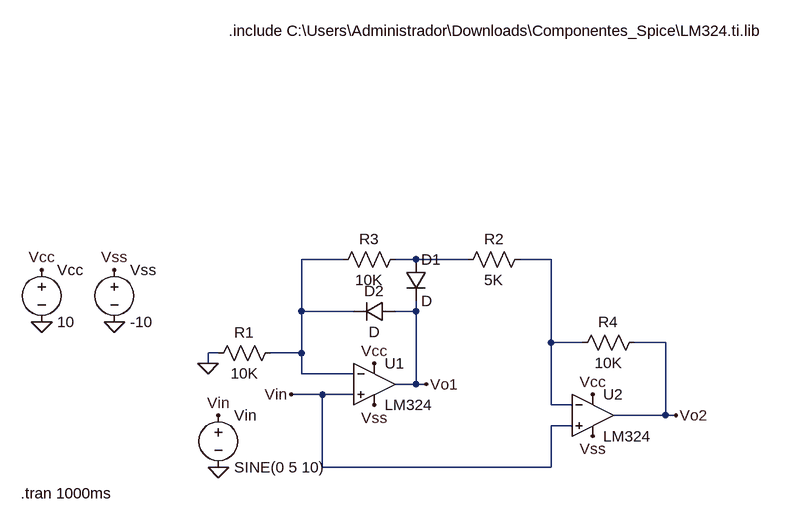
[diagram p0: schematic Rectificador.asc]
Rectificador.asc, the LTspice schematic file:
Version 4
SHEET 1 1024 680
WIRE 96 0 32 0
WIRE 208 0 176 0
WIRE 288 0 208 0
WIRE 416 0 368 0
WIRE 32 80 32 0
WIRE 112 80 32 80
WIRE 208 80 208 64
WIRE 208 80 176 80
WIRE 416 128 416 0
WIRE 464 128 416 128
WIRE 592 128 544 128
WIRE -96 144 -112 144
WIRE 32 144 32 80
WIRE 32 144 -16 144
WIRE -112 160 -112 144
WIRE 32 176 32 144
WIRE 112 176 32 176
WIRE 208 192 208 80
WIRE 208 192 176 192
WIRE 224 192 208 192
WIRE 64 208 16 208
WIRE 112 208 64 208
WIRE 416 224 416 128
WIRE 448 224 416 224
WIRE 592 240 592 128
WIRE 592 240 512 240
WIRE 608 240 592 240
WIRE 448 256 416 256
WIRE 64 320 64 208
WIRE 416 320 416 256
WIRE 416 320 64 320
FLAG -112 160 0
FLAG 16 208 Vin
FLAG 144 160 Vcc
FLAG 480 208 Vcc
FLAG 144 224 Vss
FLAG 480 272 Vss
FLAG -368 96 0
FLAG -256 96 0
FLAG -96 320 0
FLAG -96 240 Vin
FLAG -368 16 Vcc
FLAG -256 16 Vss
FLAG 608 240 Vo2
FLAG 224 192 Vo1
SYMBOL OpAmps\\opamp2 144 128 R0
SYMATTR InstName U1
SYMATTR Value LM324
SYMBOL OpAmps\\opamp2 480 176 R0
SYMATTR InstName U2
SYMATTR Value LM324
SYMBOL res 0 128 R90
WINDOW 0 0 56 VBottom 2
WINDOW 3 32 56 VTop 2
SYMATTR InstName R1
SYMATTR Value 10K
SYMBOL res 384 -16 R90
WINDOW 0 0 56 VBottom 2
WINDOW 3 32 56 VTop 2
SYMATTR InstName R2
SYMATTR Value 5K
SYMBOL res 192 -16 R90
WINDOW 0 0 56 VBottom 2
WINDOW 3 32 56 VTop 2
SYMATTR InstName R3
SYMATTR Value 10K
SYMBOL res 560 112 R90
WINDOW 0 0 56 VBottom 2
WINDOW 3 32 56 VTop 2
SYMATTR InstName R4
SYMATTR Value 10K
SYMBOL diode 192 0 R0
SYMATTR InstName D1
SYMBOL diode 176 64 R90
WINDOW 0 0 32 VBottom 2
WINDOW 3 32 32 VTop 2
SYMATTR InstName D2
SYMBOL voltage -368 0 R0
SYMATTR InstName Vcc
SYMATTR Value 10
SYMBOL voltage -256 0 R0
SYMATTR InstName Vss
SYMATTR Value -10
SYMBOL voltage -96 224 R0
WINDOW 123 0 0 Left 0
WINDOW 39 0 0 Left 0
SYMATTR InstName Vin
SYMATTR Value SINE(0 5 10)
TEXT -80 -352 Left 2 !.include C:\\Users\\Administrador\\Downloads\\Componentes_Spice\\LM324.ti.lib
TEXT -400 360 Left 2 !.tran 1000ms

The netlist it stands for:
* Rectificador.asc
XU1 Vin N001 Vcc Vss Vo1 LM324  ; pins In+ In- V+ V- OUT
XU2 Vin N003 Vcc Vss Vo2 LM324  ; pins In+ In- V+ V- OUT
R1 N001 0 10K
R2 N003 N002 5K
R3 N002 N001 10K
R4 Vo2 N003 10K
D1 N002 Vo1 D
D2 Vo1 N001 D
Vcc Vcc 0 10
Vss Vss 0 -10
Vin Vin 0 SINE(0 5 10)
.model D D
.lib standard.dio
.include C:\Users\Administrador\Downloads\Componentes_Spice\LM324.ti.lib
.tran 1000ms
.backanno
.end